# Altium schematic sheet Power.SchDoc: Power
size 292 x 193 mm; Author: James Bao; SheetNumber: 1; SheetTotal: 3
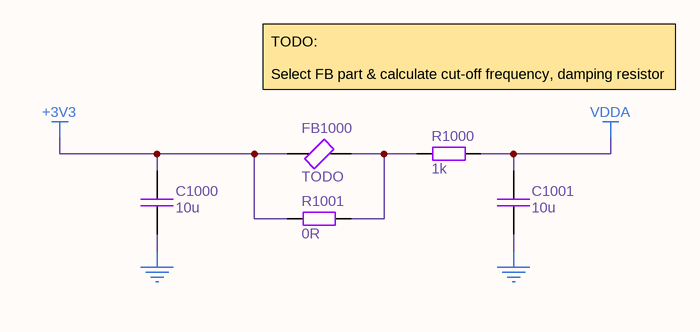
[diagram p0: Power.SchDoc]

## Parts
C1000  10u  [CC1206KKX7R8BB106_SMT_1206]
C1001  10u  [CC1206KKX7R8BB106_SMT_1206]
FB1000  TODO
R1000  1k  [RC0402FR-071KL_SMT_0402]
R1001  0R  [RC0402JR-070RL_SMT_0402]

## Nets
+3V3: C1000.2 FB1000.1 R1001.1
GND: C1000.1 C1001.1
VDDA: C1001.2 R1000.2
NetFB1000_2: FB1000.2 R1000.1 R1001.2

## Notes on the sheet
- TODO:
  Select FB part & calculate cut-off frequency, damping resistor
- Project
- algovision
- Document
- Project Revision
- Date
- Time
- Document Revision
- Sheet
- of
- Revision
- File

## Library data of the parts
C1000 C1001 = CC1206KKX7R8BB106_SMT_1206: 1206 SMT 10u 25V X7R ceramic capacitor; Manufacturer: YAGEO; Manufacturer Part Number: CC1206KKX7R8BB106; Supplier: DigiKey; Supplier Part Number: 311-1959; Package: 1206; Height (Max): 1.8; ComponentLink1Description: Datasheet; ComponentLink1URL: https://www.yageo.com/upload/media/product/productsearch/datasheet/mlcc/UPY-GPHC_X7R_6.3V-to-250V_23.pdf; ComponentLink2Description: Supplier Link; ComponentLink2URL: https://www.digikey.co.nz/en/products/detail/yageo/CC1206KKX7R8BB106/5195365
FB1000 = FERRITE: TODO FERRITE BEAD
R1000 = RC0402FR-071KL_SMT_0402: 0402 SMT 1k chip resistor; Manufacturer: YAGEO; Manufacturer Part Number: RC0402FR-071KL; Supplier: DigiKey; Supplier Part Number: 311-1.00KLR; Package: 0402; Height (Max): 0.4; ComponentLink1Description: Datasheet; ComponentLink1URL: https://www.yageo.com/upload/media/product/productsearch/datasheet/rchip/PYu-RC_Group_51_RoHS_L_12.pdf; ComponentLink2Description: Supplier Link; ComponentLink2URL: https://www.digikey.co.nz/en/products/detail/yageo/RC0402FR-071KL/726513
R1001 = RC0402JR-070RL_SMT_0402: 0402 SMT 0R jumper; Manufacturer: YAGEO; Manufacturer Part Number: RC0402JR-070RL; Supplier: DigiKey; Supplier Part Number: 311-0.0JR; Package: 0402; Height (Max): 0.4; ComponentLink1Description: Datasheet; ComponentLink1URL: https://www.yageo.com/upload/media/product/productsearch/datasheet/rchip/PYu-RC_51_RoHS_P_5.pdf; ComponentLink2Description: Supplier Link; ComponentLink2URL: https://www.digikey.co.nz/en/products/detail/yageo/RC0402JR-070RL/726406